# EAGLE schematic Analog_Input (EAGLE 9.6.2)
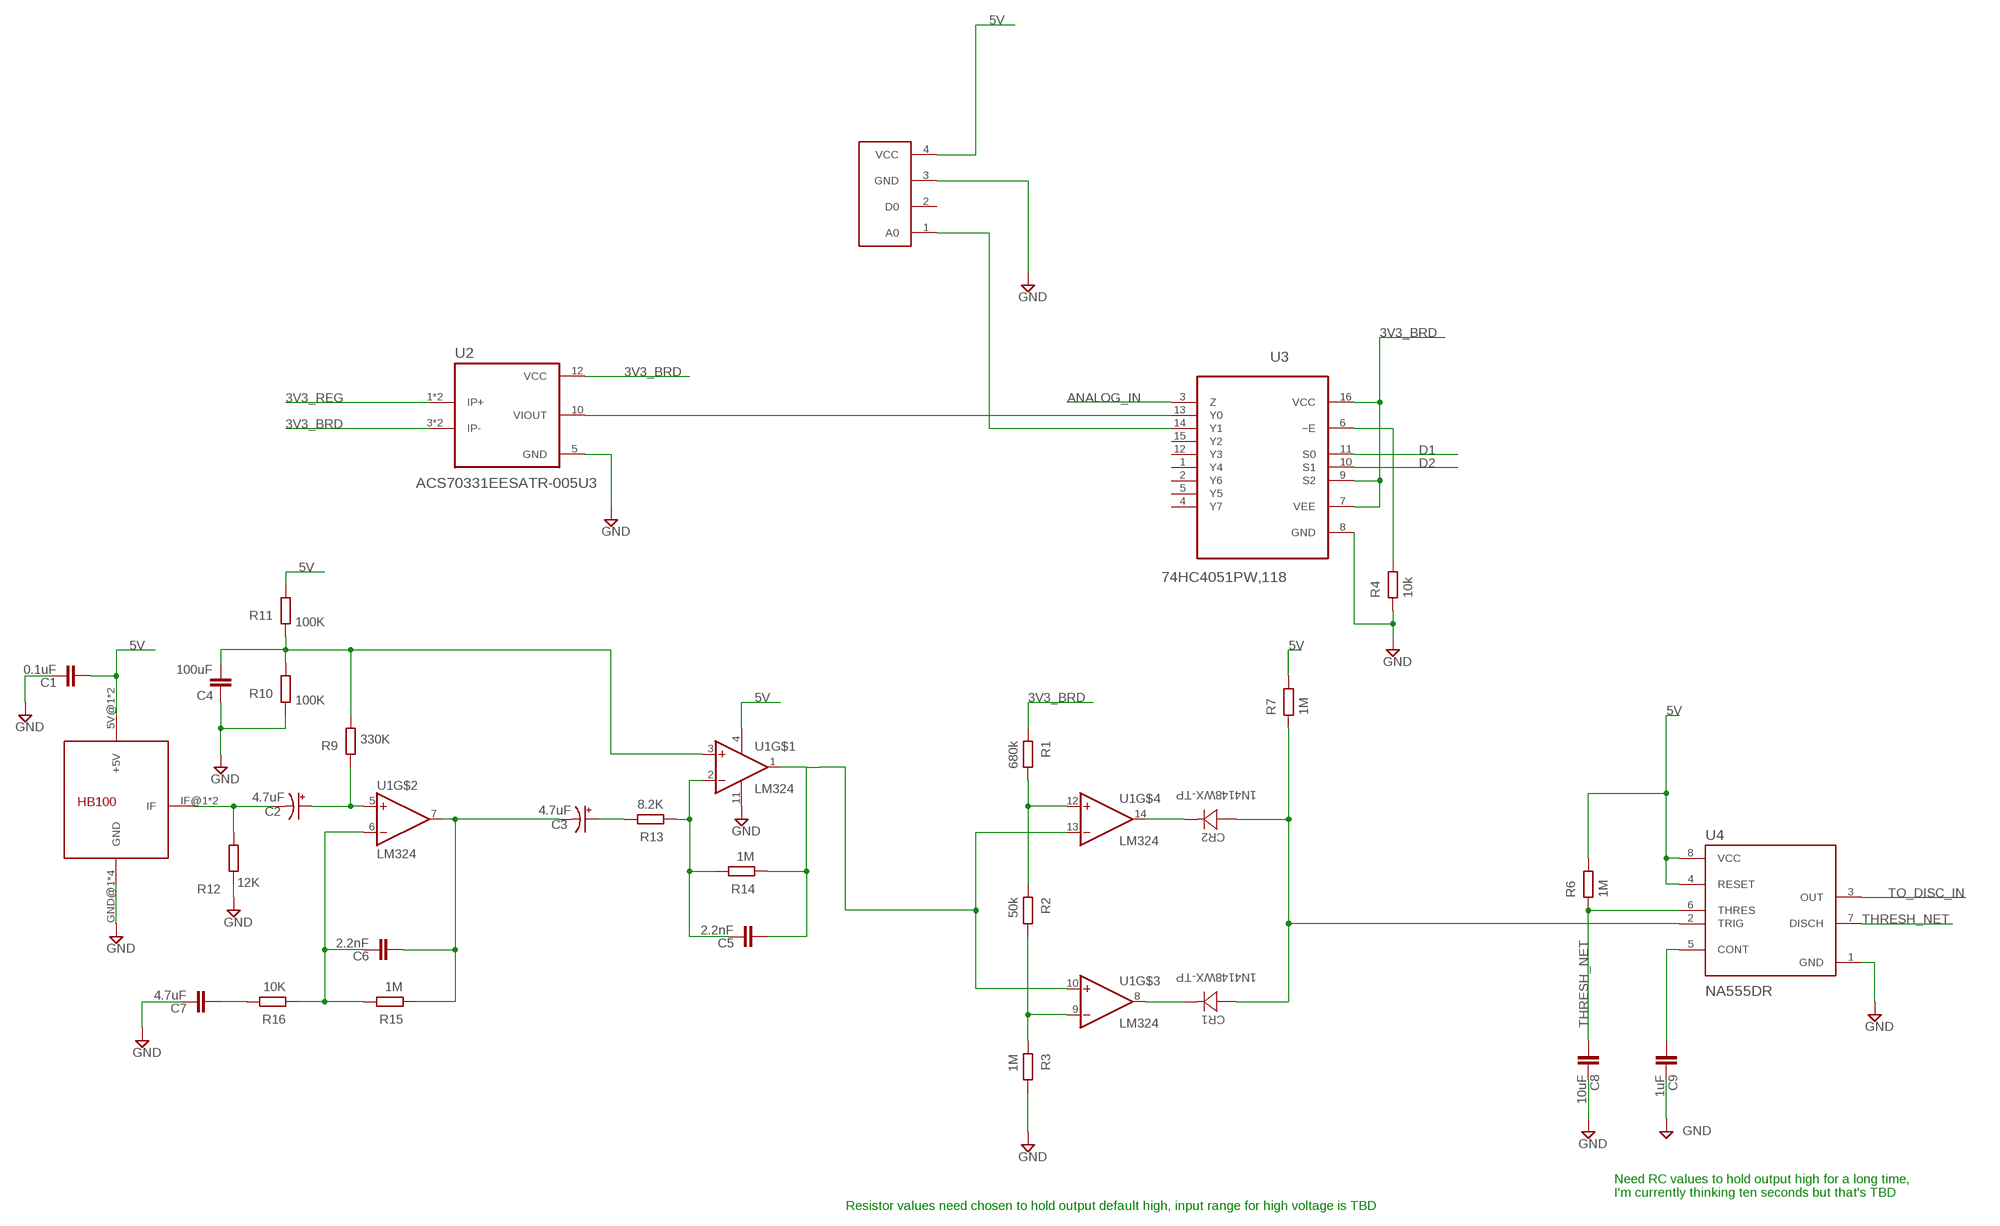
[diagram p0: schematic, sheet 1]

## Parts
C1  0.1uF  C-EUC0402  [C0402]
C2  4.7uF  CPOL-US140CLH-1010  [140CLH-1010]
C3  4.7uF  CPOL-US140CLH-1010  [140CLH-1010]
C4  100uF  C-EUC0402  [C0402]
C5  2.2nF  C-EUC0402  [C0402]
C6  2.2nF  C-EUC0402  [C0402]
C7  4.7uF  C-EUC0402  [C0402]
C8  10uF  C-EUC0402  [C0402]
C9  1uF  C-EUC0402  [C0402]
CR1  1N4148WX-TP  [CR_SOD323_MCC]
CR2  1N4148WX-TP  [CR_SOD323_MCC]
R1  680k  R  (no package)
R2  50k  R  (no package)
R3  1M  R  (no package)
R4  10k  R  (no package)
R6  1M  R  (no package)
R7  1M  R  (no package)
R9  330K  R  (no package)
R10  100K  R  (no package)
R11  100K  R  (no package)
R12  12K  R  (no package)
R13  8.2K  R  (no package)
R14  1M  R  (no package)
R15  1M  R  (no package)
R16  10K  R  (no package)
U1  LM324  [SOIC127P600X175-14N]
U2  ACS70331EESATR-005U3  [ALLEGRO_ACS70331EESATR-005U3]
U3  74HC4051PW,118  [SOP65P640X110-16N]
U4  NA555DR  [SOIC127P599X175-8N]
U$1  HB100  [HB100]
U$3  MQ_7  [MQ-7]

## Nets
3V3_BRD: R1.1 U2.3(IP-) U2.4(IP-) U2.12(VCC) U3.7(VEE) U3.9(S2) U3.16(VCC)
3V3_REG: U2.1(IP+) U2.2(IP+)
5V: C1.2 R6.2 R7.2 R11.2 U1.4(VCC+) U4.4(RESET) U4.8(VCC) U$1.5V@1(+5V) U$1.5V@2(+5V) U$3.4(VCC)
ANALOG_IN: U3.3(Z)
D1: U3.11(S0)
D2: U3.10(S1)
GND: C1.1 C4.1 C7.1 C8.1 C9.1 R3.2 R4.1 R10.1 R12.1 U1.11(VCC-) U2.5(GND) U3.8(GND) U4.1(GND) U$1.GND@1(GND) U$1.GND@2(GND) U$1.GND@3(GND) U$1.GND@4(GND) U$3.3(GND)
N$1: C2.- R12.2 U$1.IF@1(IF) U$1.IF@2(IF)
N$2: C2.+ R9.1 U1.5(NON-INVERTING_INPUT2)
N$3: C6.1 R15.2 R16.1 U1.6(INVERTING_INPUT2)
N$4: C3.- C6.2 R15.1 U1.7(OUTPUT2)
N$5: C3.+ R13.2
N$6: C5.1 R13.1 R14.2 U1.2(INVERTING_INPUT1)
N$7: U2.10(VIOUT) U3.13(Y0)
N$8: C5.2 R14.1 U1.1(OUTPUT1) U1.10(NON-INVERTING_INPUT3) U1.13(INVERTING_INPUT4)
N$9: C4.2 R9.2 R10.2 R11.1 U1.3(NON-INVERTING_INPUT1)
N$11: R1.2 R2.1 U1.12(NON-INVERTING_INPUT4)
N$12: C7.2 R16.2
N$14: R2.2 R3.1 U1.9(INVERTING_INPUT3)
N$15: CR1.1 U1.8(OUTPUT3)
N$16: U3.14(Y1) U$3.1(A0)
N$17: CR1.2 CR2.2 R7.1 U4.2(TRIG)
N$18: CR2.1 U1.14(OUTPUT4)
N$19: C9.2 U4.5(CONT)
N$21: R4.2 U3.6(~E)
THRESH_NET: C8.2 R6.1 U4.6(THRES) U4.7(DISCH)
TO_DISC_IN: U4.3(OUT)
Unconnected: U3.1(Y4) U3.2(Y6) U3.4(Y7) U3.5(Y5) U3.12(Y3) U3.15(Y2) U$3.2(D0)

## Notes on the sheet
- Need RC values to hold output high for a long time, 
  I'm currently thinking ten seconds but that's TBD
- Resistor values need chosen to hold output default high, input range for high voltage is TBD

## Library data of the parts
C1 C4-C9 = rcl:C-EU: CAPACITOR, European symbol; SPICEPREFIX: C
C2 C3 = rcl:CPOL-US: POLARIZED CAPACITOR, American symbol; SPICEPREFIX: C
CR1 CR2 = 1n4148WX-TP_Diode:1N4148WX-TP: Diode 75V 150mA surface mount; COPYRIGHT: Copyright (C) 2024 Ultra Librarian. All rights reserved.; MANUFACTURER_PART_NUMBER: 1N4148WX-TP; MFR_NAME: MCC
R1-R4 R6 R7 R9-R16 = ngspice-simulation:R: RESISTOR
U1 = LM324:LM324: these devices consist of four independent high-gain frequency-compensated operational amplifiers that are designed sp... Check availability <https://pricing.snapeda.com/parts/LM324../Intersil/view-part?ref=eda>; AVAILABILITY: Not in stock; CHECK_PRICES: https://www.snapeda.com/parts/LM324../Intersil/view-part/?ref=eda; DESCRIPTION: Op Amp Quad Low Voltage Amplifier ±2.75V/5.5V 14-Pin SOIC T/R; MF: Intersil; MP: LM324..; PACKAGE: None; PRICE: None; SNAPEDA_LINK: https://www.snapeda.com/parts/LM324../Intersil/view-part/?ref=snap
U2 = ACS70331EESATR-005U3:ACS70331EESATR-005U3: High Sensitivity, 1 Mhz, Gmr-Bas Check availability <https://pricing.snapeda.com/parts/ACS70331EESATR-005U3/Allegro%20MicroSystems%20LLC/view-part?ref=eda>; AVAILABILITY: In Stock; CHECK_PRICES: https://www.snapeda.com/parts/ACS70331EESATR-005U3/Allegro+MicroSystems+LLC/view-part/?ref=eda; DESCRIPTION: Current Sensor 5A 1 Channel Hall Effect, Open Loop Unidirectional 12-PowerWFQFN; MF: Allegro MicroSystems LLC; MP: ACS70331EESATR-005U3; PACKAGE: WFQFN-12 Allegro MicroSystems LLC; PRICE: None; PURCHASE-URL: https://www.snapeda.com/api/url_track_click_mouser/?unipart_id=2732756&manufacturer=Allegro MicroSystems LLC&part_name=ACS70331EESATR-005U3&search_term=None; SNAPEDA_LINK: https://www.snapeda.com/parts/ACS70331EESATR-005U3/Allegro+MicroSystems+LLC/view-part/?ref=snap
U3 = 74HC4051PW_118:74HC4051PW,118: 8-channel analog multiplexer/demultiplexer Check availability <https://pricing.snapeda.com/parts/74HC4051PW%2C118/Nexperia%20USA%20Inc./view-part?ref=eda>; AVAILABILITY: In Stock; CHECK_PRICES: https://www.snapeda.com/parts/74HC4051PW,118/Nexperia/view-part/?ref=eda; DESCRIPTION: 1 Circuit IC Switch 8:1 120Ohm 16-TSSOP; MF: Nexperia USA Inc.; MP: 74HC4051PW,118; PACKAGE: TSSOP-16 Texas Instruments; PRICE: None; PURCHASE-URL: https://www.snapeda.com/api/url_track_click_mouser/?unipart_id=5160680&manufacturer=Nexperia USA Inc.&part_name=74HC4051PW,118&search_term=None; SNAPEDA_LINK: https://www.snapeda.com/parts/74HC4051PW,118/Nexperia/view-part/?ref=snap
U4 = NA555DR:NA555DR: Precision Timers 8-SOIC -40 to 105; MANUFACTURER: Texas Instruments; MAXIMUM_PACKAGE_HEIGHT: 1.75mm; PARTREV: I; STANDARD: IPC-7351B
U$1 = HB100_Doppler:HB100: HB100 Doppler Radar Sensor
U$3 = MQ_7:MQ_7: MQ_7 gas sensor, this part can be used for all of the 'MQ' series of gas sensors (the dev board not the sensor by itself)